# Altium schematic sheet WG-DH-MB.SchDoc
size D
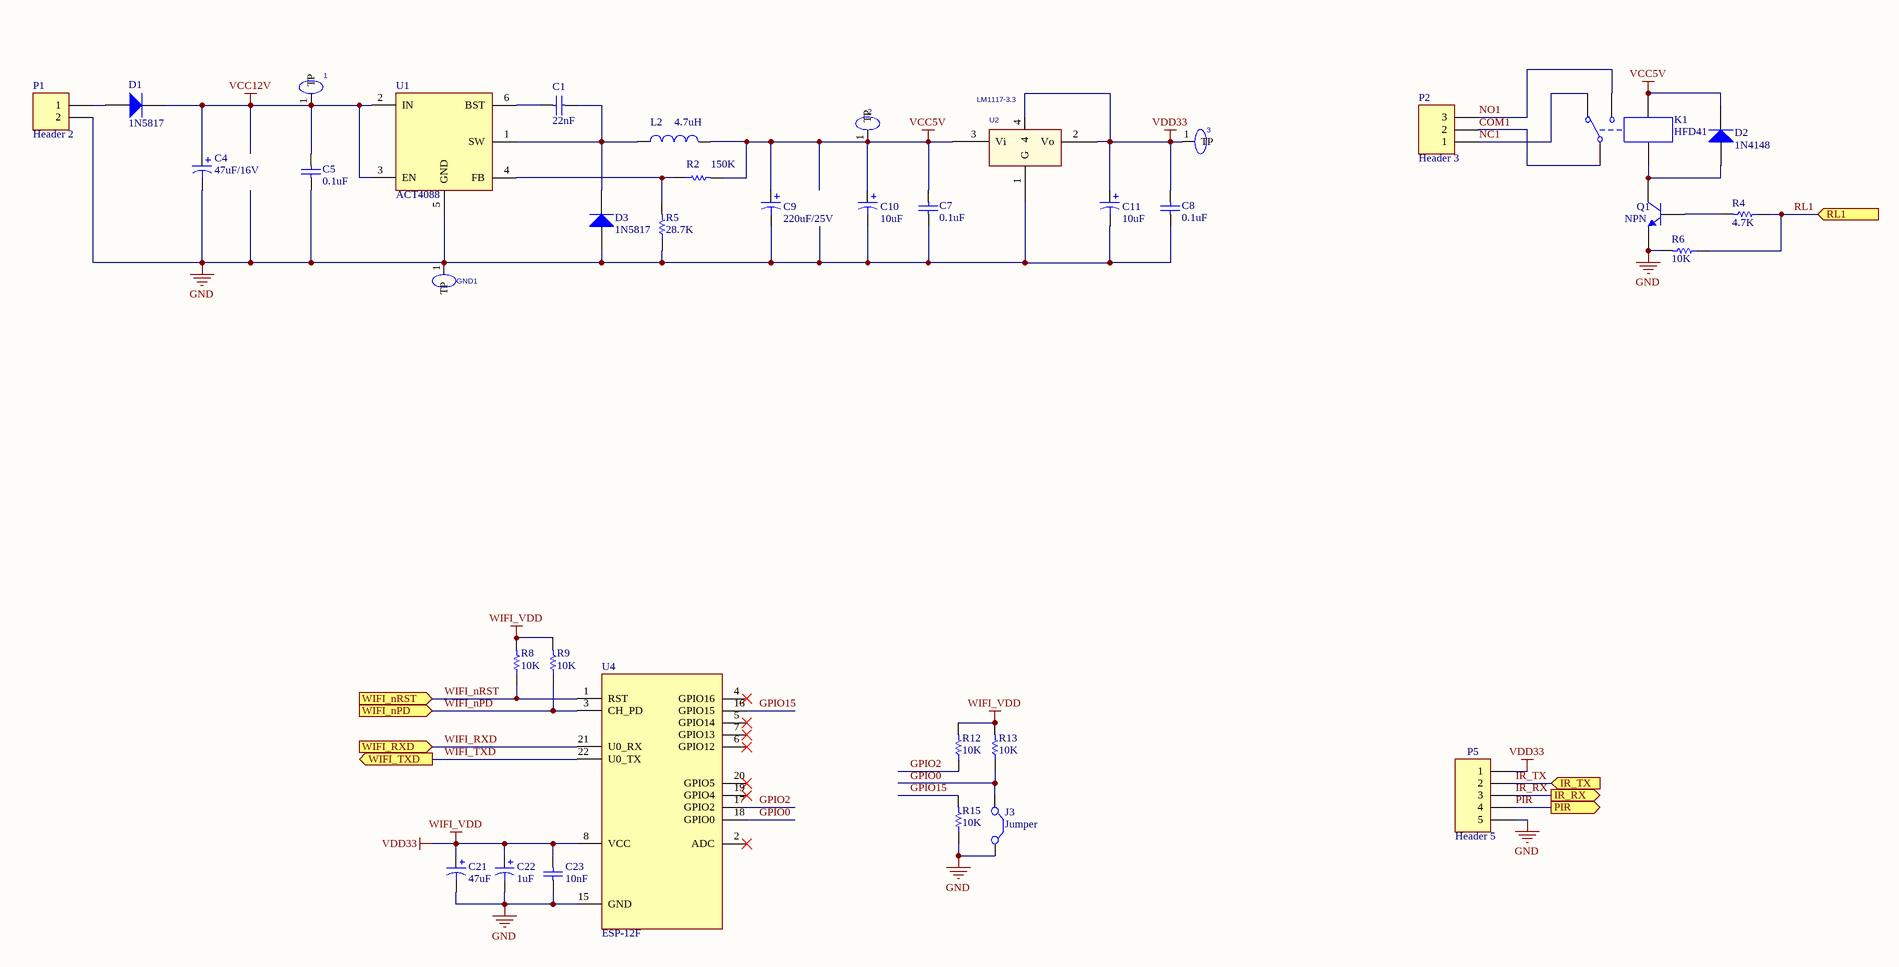
[diagram p0: WG-DH-MB.SchDoc, top left]
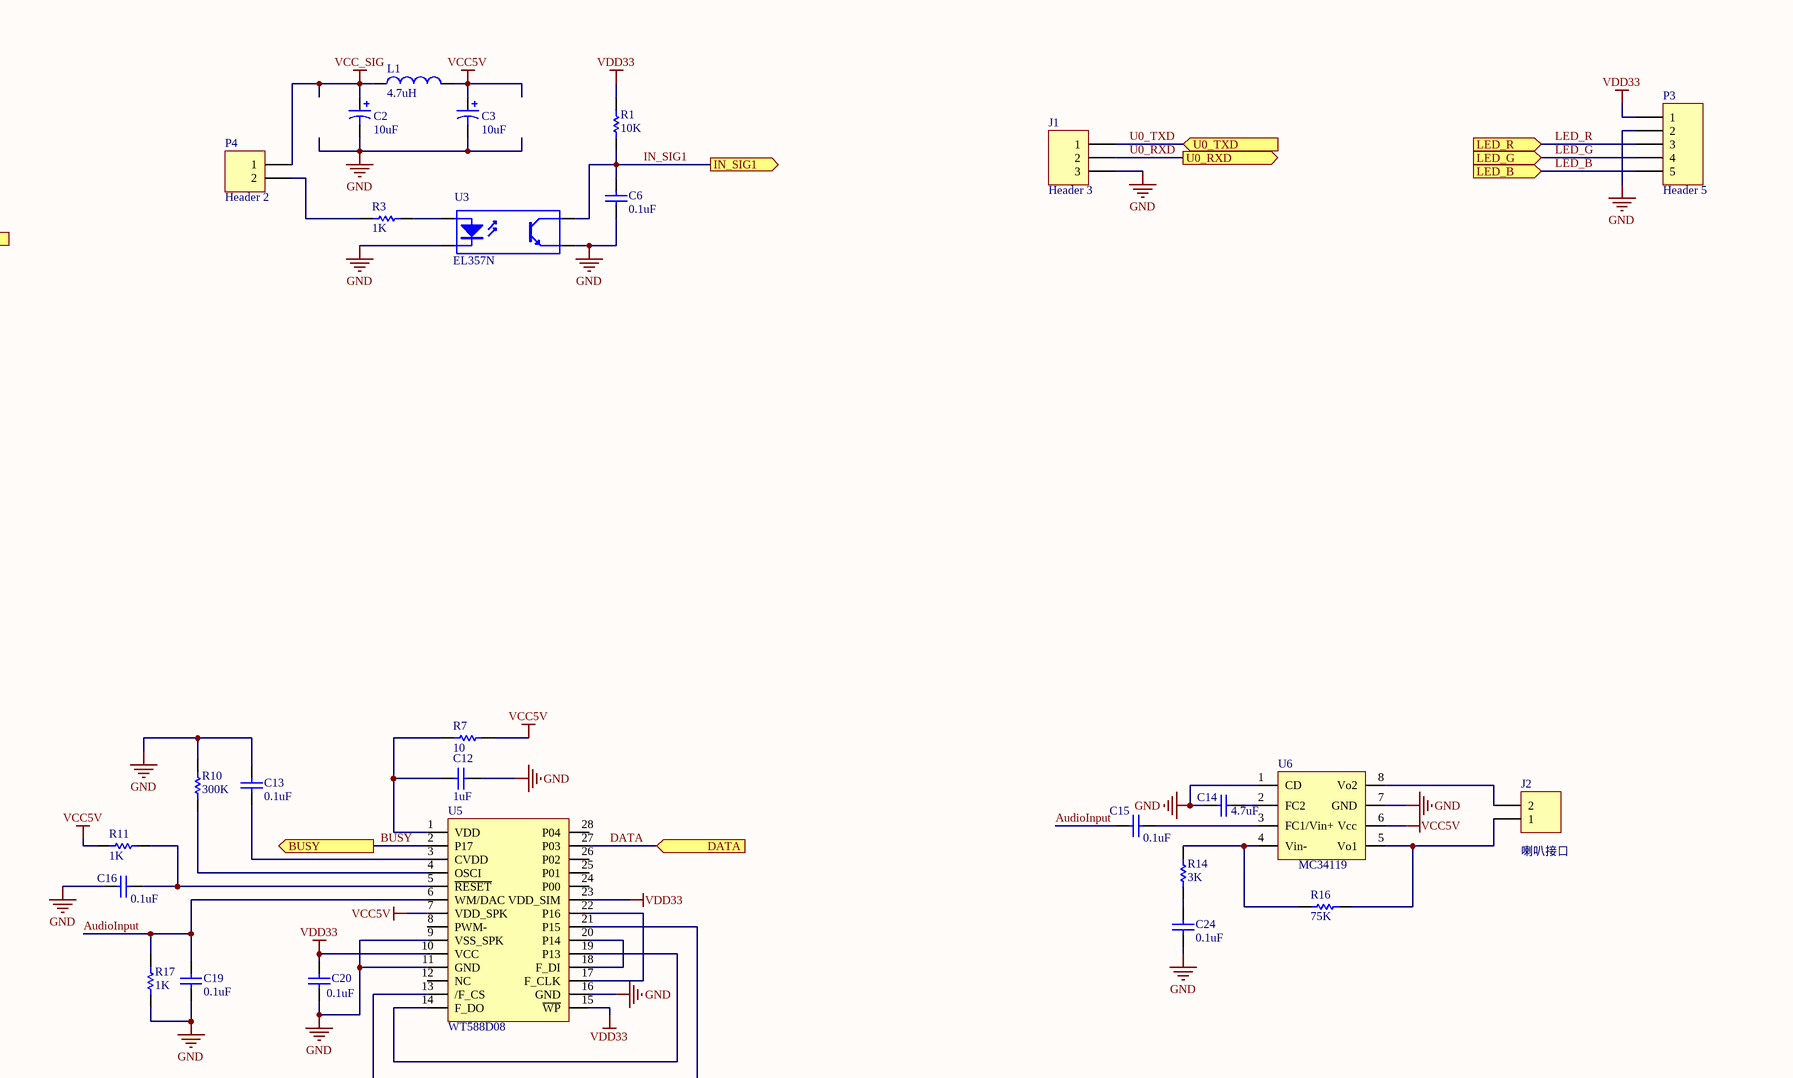
[diagram p1: WG-DH-MB.SchDoc, top right]
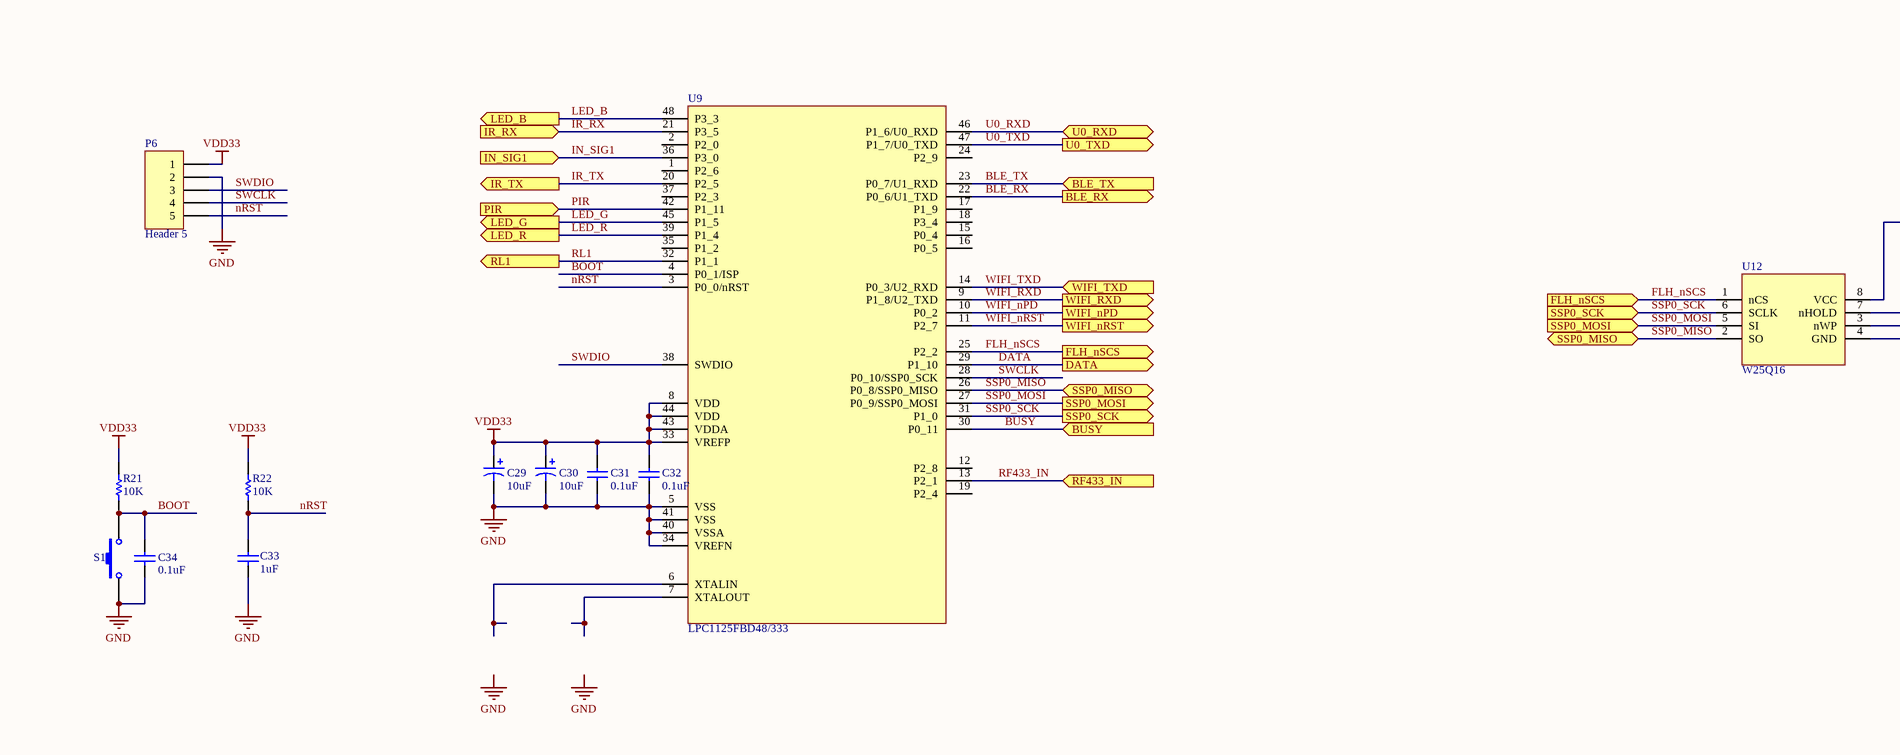
[diagram p2: WG-DH-MB.SchDoc, bottom left]
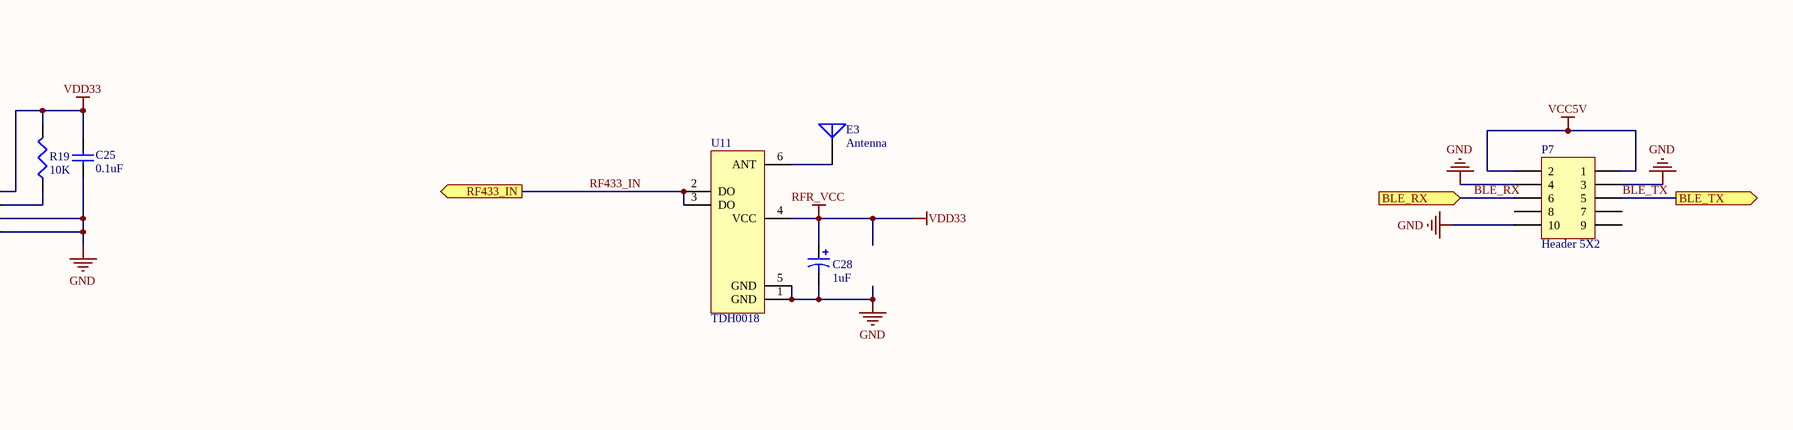
[diagram p3: WG-DH-MB.SchDoc, bottom right]

## Parts
1  5VOUT  [TestPoint]  (value not drawn)
2  5VOUT  [TestPoint]  (value not drawn)
3  5VOUT  [TestPoint]  (value not drawn)
C1  22nF  [0805 - C]
C2  10uF  [0805 - C]
C3  10uF  [0805 - C]
C4  47uF/16V  [smd_ec_d5.2]
C5  0.1uF  [0805 - C]
C6  0.1uF  [0805 - C]
C7  0.1uF  [0805 - C]
C8  0.1uF  [0805 - C]
C9  220uF/25V  [smd_ec_d8]
C10  10uF  [0805 - C]
C11  10uF  [0805 - C]
C12  1uF  [0805 - C]
C13  0.1uF  [0805 - C]
C14  4.7uF  [0805 - C]
C15  0.1uF  [0805 - C]
C16  0.1uF  [0805 - C]
C19  0.1uF  [0805 - C]
C20  0.1uF  [0805 - C]
C21  47uF  [SMD_EC_D5.2]
C22  1uF  [0805 - C]
C23  10nF  [0805 - C]
C24  0.1uF  [0805 - C]
C25  0.1uF  [0805 - C]
C28  1uF  [0805 - C]
C29  10uF  [0805 - C]
C30  10uF  [0805 - C]
C31  0.1uF  [0805 - C]
C32  0.1uF  [0805 - C]
C33  1uF  [0805 - C]
C34  0.1uF  [0805 - C]
D1  1N5817  [SMD_DIODE_SMA]
D2  1N4148  [1n4148]
D3  1N5817  [SMD_DIODE_SMA]
E3  Antenna  [ant]
GND1  5VOUT  [TestPoint]  (value not drawn)
J1  Header 3  [HDR1X3]
J2  喇叭接口  [CN_1X2_P200]
J3  Jumper  [HDR1X2]
K1  HFD41  [HFD23]
L1  4.7uH  [SMD_L_3015]
L2  4.7uH  [SMD_L_3015]
P1  Header 2  [CON2-5.08]
P2  Header 3  [CN_1X3_P200]
P3  Header 5  [CN_1X5_P200]
P4  Header 2  [CN_1X2_P200]
P5  Header 5  [HDR1X5]
P6  Header 5  [CN_1X5_P200]
P7  Header 5X2  [HDR2X5]
Q1  NPN  [SOT23]
R1  10K  [0805 - R]
R2  150K  [0805 - R]
R3  1K  [0805 - R]
R4  4.7K  [0805 - R]
R5  28.7K  [0805 - R]
R6  10K  [0805 - R]
R7  10  [0805 - R]
R8  10K  [0805 - R]
R9  10K  [0805 - R]
R10  300K  [0805 - R]
R11  1K  [0805 - R]
R12  10K  [0805 - R]
R13  10K  [0805 - R]
R14  3K  [0805 - R]
R15  10K  [0805 - R]
R16  75K  [0805 - R]
R17  1K  [0805 - R]
R19  10K  [0805 - R]
R21  10K  [0805 - R]
R22  10K  [0805 - R]
S1  SW-PB  [SW_SMD_2P]  (value not drawn)
U1  ACT4088  [SOT23-6]
U2  LM1117-3.3  [SOT223]
U3  EL357N  [SOP4]
U4  ESP-12F  [WIFI-ESP]
U5  WT588D08  [WT588D08]
U6  MC34119  [MC34119]
U9  LPC1125FBD48/333  [TQFP48]
U11  TDH0018  [TDH0018]
U12  W25Q16  [CN_4X2P_1.27MM]

## Ports
BLE_RX (in), BLE_RX (out), BLE_TX (in), BLE_TX (out), BUSY (in), BUSY (out), DATA (in), DATA (out), FLH_nSCS (in), FLH_nSCS (out), IN_SIG1 (in), IN_SIG1 (out), IR_RX (in), IR_RX (out), IR_TX (in), IR_TX (out), LED_B (in), LED_B (out), LED_G (in), LED_G (out), LED_R (in), LED_R (out), PIR (in), PIR (out), RF433_IN (in), RF433_IN (out), RL1 (in), RL1 (out), SSP0_MISO, SSP0_MOSI (in), SSP0_MOSI (out), SSP0_SCK (in), SSP0_SCK (out), U0_RXD, U0_RXD (out), U0_TXD (in), U0_TXD (out), WIFI_nPD (in), WIFI_nPD (out), WIFI_nRST (in), WIFI_nRST (out), WIFI_RXD (in), WIFI_RXD (out), WIFI_TXD (in), WIFI_TXD (out)

## Nets
GND: C2.2 C3.2 C4.2 C5.1 C6.1 C7.1 C8.1 C9.2 C10.2 C11.2 C12.1 C13.1 C14.2 C16.1 C19.2 C20.2 C21.2 C22.2 C23.1 C24.1 C25.1 C28.2 C29.2 C30.2 C31.1 C32.1 C33.1 C34.1 D3.1(A) GND1.1(TP) J1.3 J3.2(C2) P1.2 P3.2 P5.5 P6.2 P7.3 P7.4 P7.10 Q1.3(E) R5.1 R6.2 R10.2 R15.1 R17.1 S1.1 U1.5(GND) U2.1(G) U3.2(K) U3.3(E) U4.15(GND) U5.9(VSS_SPK) U5.11(GND) U5.16(GND) U6.1(CD) U6.7(GND) U9.5(VSS) U9.34(VREFN) U9.40(VSSA) U9.41(VSS) U11.1(GND) U11.5(GND) U12.3(nWP) U12.4(GND)
RFR_VCC: 3.1(TP) C8.2 C11.1 C20.1 C21.1 C22.1 C23.2 C25.2 C28.1 C29.1 C30.1 C31.2 C32.2 P3.1 P5.1 P6.1 R1.1 R8.2 R9.2 R12.2 R13.2 R19.2 R21.1 R22.1 U2.2(Vo) U2.4 U4.8(VCC) U5.10(VCC) U5.15(~{WP}) U5.23(VDD_SIM) U9.8(VDD) U9.33(VREFP) U9.43(VDDA) U9.44(VDD) U11.4(VCC) U12.8(VCC)  [also labelled VDD33, WIFI_VDD]
VCC5V: 2.1(TP) C3.1 C7.2 C9.1 C10.1 D2.2(K) K1.5 L1.2 L2.2 P7.1 P7.2 R2.2 R7.1 R11.2 U2.3(Vi) U5.7(VDD_SPK) U6.6(Vcc)
VCC12V: 1.1(TP) C4.1 C5.2 D1.2(K) U1.2(IN) U1.3(EN)
VCC_SIG: C2.1 L1.1 P4.1
AudioInput: C15.1 C19.1 R17.2 U5.6(WM/DAC)
BLE_RX: P7.6 U9.22(P0_6/U1_TXD) ; port BLE_RX
BLE_TX: P7.5 U9.23(P0_7/U1_RXD) ; port BLE_TX
BOOT: C34.2 R21.2 S1.2 U9.4(P0_1/ISP)
BUSY: U5.2(P17) U9.30(P0_11) ; port BUSY
COM1: K1.1 P2.2
DATA: U5.27(P03) U9.29(P1_10) ; port DATA
FLH_nSCS: U9.25(P2_2) U12.1(nCS) ; port FLH_nSCS
GPIO0: J3.1(C1) R13.1 U4.18(GPIO0)
GPIO2: R12.1 U4.17(GPIO2)
GPIO15: R15.2 U4.16(GPIO15)
IN_SIG1: C6.2 R1.2 U3.4(C) U9.36(P3_0) ; port IN_SIG1
IR_RX: P5.3 U9.21(P3_5) ; port IR_RX
IR_TX: P5.2 U9.20(P2_5) ; port IR_TX
LED_B: P3.5 U9.48(P3_3) ; port LED_B
LED_G: P3.4 U9.45(P1_5) ; port LED_G
LED_R: P3.3 U9.39(P1_4) ; port LED_R
NC1: K1.2 P2.1
NO1: K1.3 P2.3
nRST: C33.2 P6.5 R22.2 U9.3(P0_0/nRST)
PIR: P5.4 U9.42(P1_11) ; port PIR
RF433_IN: U9.13(P2_1) U11.2(DO) U11.3(DO) ; port RF433_IN
RL1: R4.1 R6.1 U9.32(P1_1) ; port RL1
SSP0_MISO: U9.26(P0_8/SSP0_MISO) U12.2(SO) ; port SSP0_MISO
SSP0_MOSI: U9.27(P0_9/SSP0_MOSI) U12.5(SI) ; port SSP0_MOSI
SSP0_SCK: U9.31(P1_0) U12.6(SCLK) ; port SSP0_SCK
SWCLK: P6.4 U9.28(P0_10/SSP0_SCK)
SWDIO: P6.3 U9.38(SWDIO)
U0_RXD: J1.2 U9.46(P1_6/U0_RXD) ; port U0_RXD
U0_TXD: J1.1 U9.47(P1_7/U0_TXD) ; port U0_TXD
WIFI_nPD: R9.1 U4.3(CH_PD) U9.10(P0_2) ; port WIFI_nPD
WIFI_nRST: R8.1 U4.1(RST) U9.11(P2_7) ; port WIFI_nRST
WIFI_RXD: U4.21(U0_RX) U9.9(P1_8/U2_TXD) ; port WIFI_RXD
WIFI_TXD: U4.22(U0_TX) U9.14(P0_3/U2_RXD) ; port WIFI_TXD
NetC1_1: C1.1 D3.2(K) L2.1 U1.1(SW)
NetC1_2: C1.2 U1.6(BST)
NetC12_2: C12.2 R7.2 U5.1(VDD)
NetC13_2: C13.2 U5.3(CVDD)
NetC14_1: C14.1 U6.2(FC2)
NetC15_2: C15.2 U6.3(FC1/Vin+)
NetC16_2: C16.2 R11.1 U5.5(~{RESET})
NetC24_2: C24.2 R14.1
NetD1_1: D1.1(A) P1.1
NetD2_1: D2.1(A) K1.4 Q1.1(C)
NetE3_1: E3.1(A) U11.6(ANT)
NetJ2_1: J2.1 R16.1 U6.5(Vo1)
NetJ2_2: J2.2 U6.8(Vo2)
NetP4_2: P4.2 R3.2
NetQ1_2: Q1.2(B) R4.2
NetR2_1: R2.1 R5.2 U1.4(FB)
NetR3_1: R3.1 U3.1(A)
NetR10_1: R10.1 U5.4(OSCI)
NetR14_2: R14.2 R16.2 U6.4(Vin-)
NetR19_1: R19.1 U12.7(nHOLD)
NetU5_13: U5.13(/F_CS) U5.21(P15)
NetU5_14: U5.14(F_DO) U5.19(P13)
NetU5_17: U5.17(F_CLK) U5.22(P16)
NetU5_18: U5.18(F_DI) U5.20(P14)

Not connected (* = marked no-connect by the designer): P7 7 8 9; U4 2(ADC)* 4(GPIO16)* 5(GPIO14)* 6(GPIO12)* 7(GPIO13)* 19(GPIO4)* 20(GPIO5)*; U5 8(PWM-) 12(NC) 24(P00) 25(P01) 26(P02) 28(P04); U9 1(P2_6) 2(P2_0) 6(XTALIN) 7(XTALOUT) 12(P2_8) 15(P0_4) 16(P0_5) 17(P1_9) 18(P3_4) 19(P2_4) 24(P2_9) 35(P1_2) 37(P2_3)

## Notes on the sheet
- Labels drawn without touching a wire or pin: GND

## Library data of the parts
1-3 GND1 = TESTPOINT
C1 C5-C8 C12-C16 C19 C20 C23-C25 C31-C34 = Cap: Capacitor; Value: 100pF; Published: 8-Jun-2000; LatestRevisionDate: 17-Jul-2002; LatestRevisionNote: Re-released for DXP Platform.; PackageReference: RAD-0.3; Publisher: Altium Limited; PackageDescription: Radial Cap, Thru-Hole; 2 Leads; 0.3 in Pin Spacing
C2-C4 C9-C11 C21 C22 C28-C30 = Cap Pol1: Polarized Capacitor (Radial); Value: 100pF; Published: 8-Jun-2000; LatestRevisionDate: 17-Jul-2002; LatestRevisionNote: Re-released for DXP Platform.; PackageReference: RB7.6-15; Publisher: Altium Limited; PackageDescription: Polarized Capacitor (Radial); 2 Leads
D1-D3 = Diode: Default Diode; Published: 8-Jun-2000; LatestRevisionDate: 17-Jul-2002; LatestRevisionNote: Re-released for DXP Platform.; PackageVersion: Sep-1996; PackageReference: SMC; Publisher: Altium Limited; PackageDescription: DO-214-AB/SMC; 2 C-Bend Leads; Body 7.9 x 5.9 mm, inc. leads (LxW); Code_JEDEC: DO-214-AB
E3 = Antenna: Generic Antenna; Published: 24-Mar-1999; LatestRevisionDate: 17-Jul-2002; LatestRevisionNote: Re-released for DXP Platform.; PackageReference: PIN1; Publisher: Altium Limited
J1 P2 = Header 3: Header, 3-Pin; LatestRevisionDate: 17-Jul-2002; LatestRevisionNote: Re-released for DXP Platform.; Publisher: Altium Limited
J2 P1 P4 = Header 2: Header, 2-Pin; LatestRevisionDate: 17-Jul-2002; LatestRevisionNote: Re-released for DXP Platform.; Publisher: Altium Limited
J3 = Jumper: Jumper Wire; Published: 24-Mar-1999; LatestRevisionDate: 17-Jul-2002; LatestRevisionNote: Re-released for DXP Platform.; PackageReference: RAD-0.2; Publisher: Altium Limited; PackageDescription: Radial Cap, Thru-Hole; 2 Leads; 0.2 in Pin Spacing
K1 = Relay-SPDT: Single-Pole Dual-Throw Relay; Published: 24-Mar-1999; LatestRevisionDate: 17-Jul-2002; LatestRevisionNote: Re-released for DXP Platform.; PackageReference: MODULE5B; Publisher: Altium Limited
L1 L2 = Inductor: Code_IEC: 1005; Value: 10mH; Published: 8-Jun-2000; LatestRevisionDate: 29-May-2009; LatestRevisionNote: IPC-7351 Footprint Added.; PackageReference: 0402-A; Publisher: Altium Limited; PackageDescription: Chip Inductor; Code_JEITA: 0402
P3 P5 P6 = Header 5: Header, 5-Pin; LatestRevisionDate: 17-Jul-2002; LatestRevisionNote: Re-released for DXP Platform.; Publisher: Altium Limited
P7 = Header 5X2: Header, 5-Pin, Dual row; LatestRevisionDate: 17-Jul-2002; LatestRevisionNote: Re-released for DXP Platform.; Publisher: Altium Limited
Q1 = NPN: NPN Bipolar Transistor; Published: 8-Jun-2000; LatestRevisionDate: 17-Jul-2002; LatestRevisionNote: Re-released for DXP Platform.; PackageReference: TO-226-AA; Publisher: Altium Limited; PackageDescription: TO, Flat Index; 3 In-Line, Axial Leads; Body Dia. 4.8mm; Leads 0.55 x 0.51 mm (max); Code_JEDEC: TO-226-AA
R1 R2 R4-R10 R12-R16 R21 R22 = Res1: Resistor; Value: 1K; Published: 8-Jun-2000; LatestRevisionDate: 17-Jul-2002; LatestRevisionNote: Re-released for DXP Platform.; PackageReference: AXIAL-0.3; Publisher: Altium Limited; PackageDescription: Axial Device, Thru-Hole; 2 Leads; 0.3 in Pin Spacing
R3 R11 R17 = Res1: Resistor; Published: 8-Jun-2000; LatestRevisionDate: 17-Jul-2002; LatestRevisionNote: Re-released for DXP Platform.; PackageReference: AXIAL-0.3; Publisher: Altium Limited; PackageDescription: Axial Device, Thru-Hole; 2 Leads; 0.3 in Pin Spacing; Value: 1K
R19 = Res3: Resistor; Value: 1K; Published: 8-Jun-2000; LatestRevisionDate: 29-May-2009; LatestRevisionNote: IPC-7351 Footprint Added.; PackageReference: J1-0603; Publisher: Altium Limited; PackageDescription: Chip Resistor
S1 = SW-PB: Switch; Published: 24-Mar-1999; LatestRevisionDate: 17-Jul-2002; LatestRevisionNote: Re-released for DXP Platform.; PackageReference: SPST-2; Publisher: Altium Limited; PackageDescription: Switch; 2 Leads
U2 = LM1117_1
U3 = Optoisolator1: 4-Pin Phototransistor Optocoupler; Published: 24-Mar-1999; LatestRevisionDate: 04-Mar-2005; LatestRevisionNote: Sch pins 3 & 4 Swapped.; DatasheetVersion: Nov-2003; PackageReference: DIP-4; Publisher: Altium Limited
U12 = MX25Lxx